# EAGLE schematic LightFixture1 (EAGLE 7.7.0)
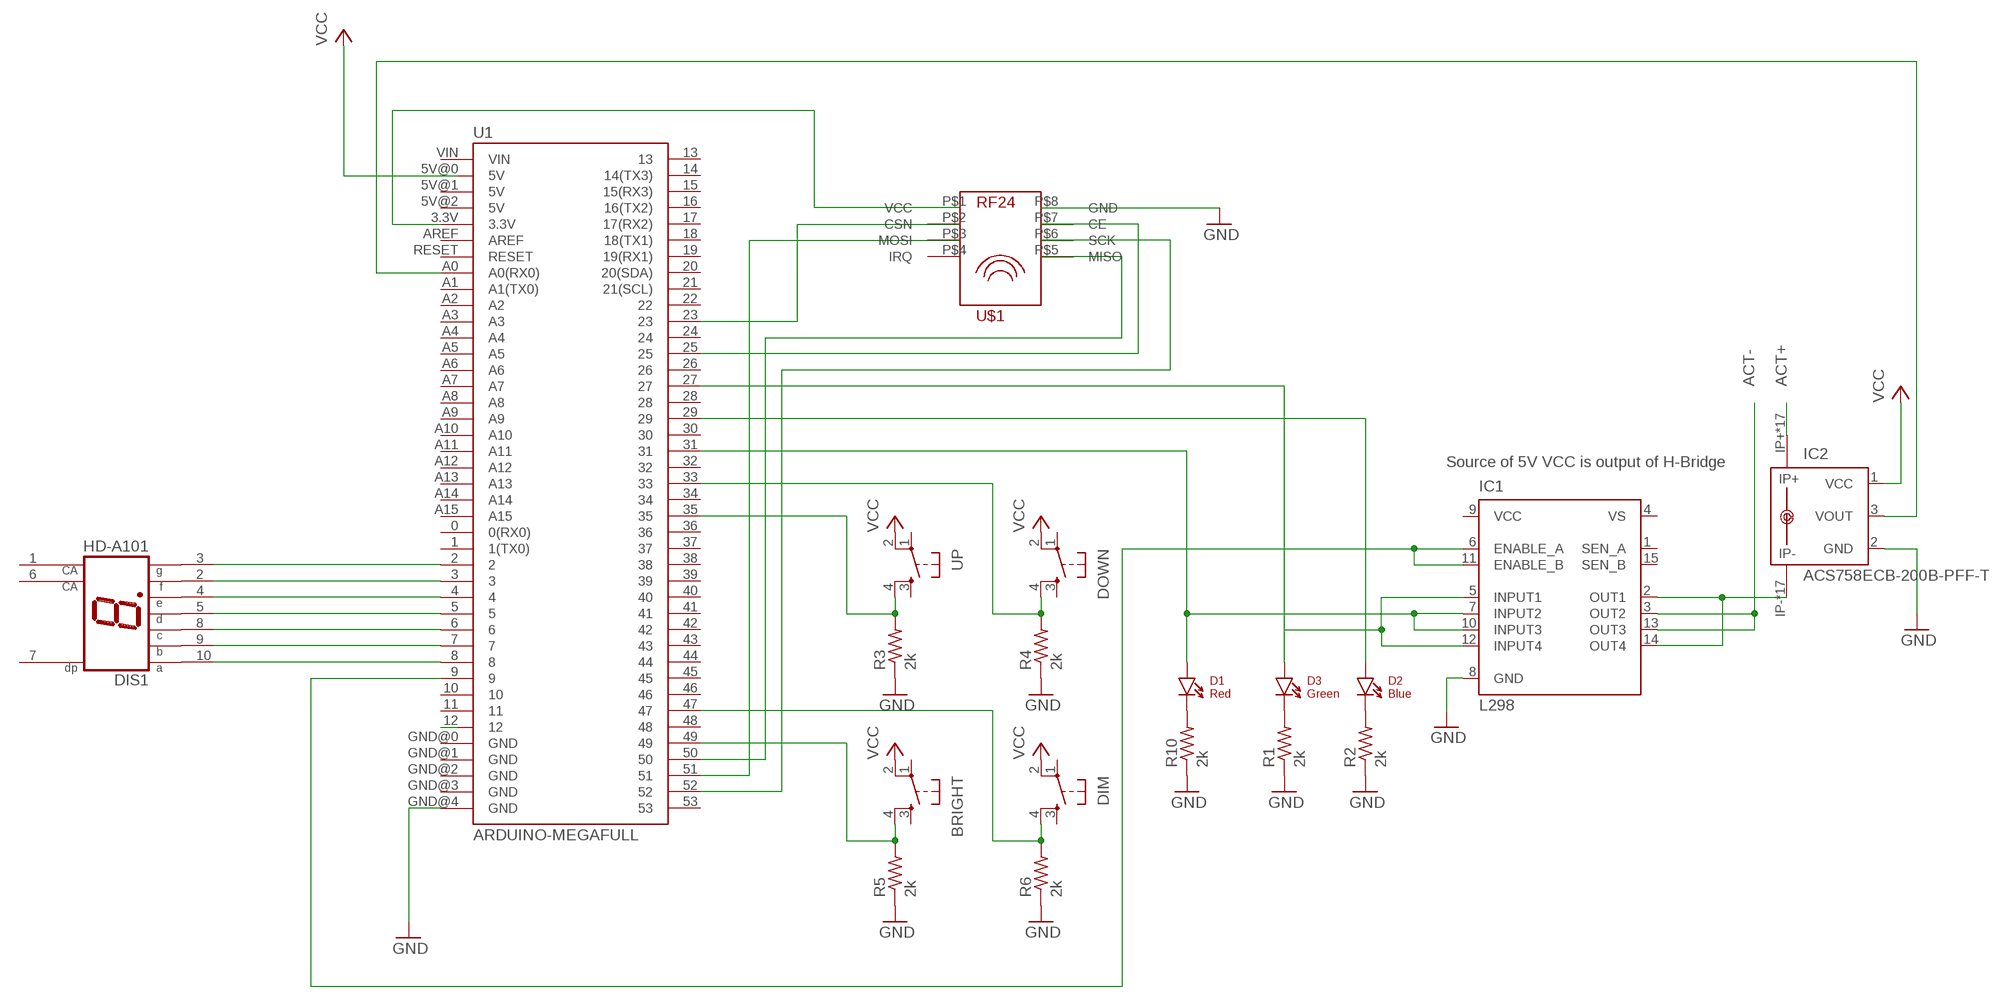
[diagram p0: schematic, sheet 1]

## Parts
BRIGHT  TAC_SWITCHPTH  [TACTILE-PTH]
D1  Red  LTE-302  [LTE-302]
D2  Blue  LTE-302  [LTE-302]
D3  Green  LTE-302  [LTE-302]
DIM  TAC_SWITCHPTH  [TACTILE-PTH]
DIS1  HD-A101  [HDSP-A]
DOWN  TAC_SWITCHPTH  [TACTILE-PTH]
IC1  L298  [MULTIWATT-15]
IC2  ACS758ECB-200B-PFF-T  [CB-PFF]
R1  2k  R-US_R0201  [R0201]
R2  2k  R-US_R0201  [R0201]
R3  2k  R-US_R0201  [R0201]
R4  2k  R-US_R0201  [R0201]
R5  2k  R-US_R0201  [R0201]
R6  2k  R-US_R0201  [R0201]
R10  2k  R-US_R0201  [R0201]
U1  ARDUINO-MEGAFULL  [ARDUINO_MEGA]
U$1  NRF24  [RF24]
UP  TAC_SWITCHPTH  [TACTILE-PTH]

## Nets
GND: IC1.8(GND) IC2.2(GND) R1.1 R2.1 R3.1 R4.1 R5.1 R6.1 R10.1 U1.GND@4(GND) U$1.P$8(GND)
N$1: D1.C R10.2
N$2: D3.C R1.2
N$3: D2.C R2.2
N$4: DOWN.4 R4.2 U1.33
N$5: R3.2 U1.35 UP.4
N$6: IC1.5(INPUT1) IC1.12(INPUT4)
N$7: IC1.6(ENABLE_A) IC1.11(ENABLE_B) U1.9
N$8: IC1.2(OUT1) IC1.14(OUT4) IC2.IP- IC2.IP-@2(IP-) IC2.IP-@3(IP-) IC2.IP-@4(IP-) IC2.IP-@5(IP-) IC2.IP-@6(IP-) IC2.IP-@7(IP-) IC2.IP-@8(IP-) IC2.IP-@9(IP-) IC2.IP-@10(IP-) IC2.IP-@11(IP-) IC2.IP-@12(IP-) IC2.IP-@13(IP-) IC2.IP-@14(IP-) IC2.IP-@15(IP-) IC2.IP-@16(IP-) IC2.IP-@17(IP-)
N$9: IC1.3(OUT2) IC1.13(OUT3)
N$10: IC2.3(VOUT) U1.A0(A0(RX0))
N$11: IC2.IP+ IC2.IP+@2(IP+) IC2.IP+@3(IP+) IC2.IP+@4(IP+) IC2.IP+@5(IP+) IC2.IP+@6(IP+) IC2.IP+@7(IP+) IC2.IP+@8(IP+) IC2.IP+@9(IP+) IC2.IP+@10(IP+) IC2.IP+@11(IP+) IC2.IP+@12(IP+) IC2.IP+@13(IP+) IC2.IP+@14(IP+) IC2.IP+@15(IP+) IC2.IP+@16(IP+) IC2.IP+@17(IP+)
N$12: D1.A IC1.7(INPUT2) IC1.10(INPUT3) U1.31
N$13: D3.A U1.27
N$14: U1.3.3V U$1.P$1(VCC)
N$15: U1.23 U$1.P$2(CSN)
N$16: U1.51 U$1.P$3(MOSI)
N$17: U1.50 U$1.P$5(MISO)
N$18: U1.52 U$1.P$6(SCK)
N$19: U1.25 U$1.P$7(CE)
N$20: D2.A U1.29
N$21: DIS1.3(G) U1.2
N$22: DIS1.2(F) U1.3
N$23: DIS1.4(E) U1.4
N$24: DIS1.5(D) U1.5
N$25: DIS1.8(C) U1.6
N$26: DIS1.9(B) U1.7
N$27: DIS1.10(A) U1.8
N$28: DIM.4 R6.2
N$29: BRIGHT.4 R5.2
N$30: U1.12
VCC: BRIGHT.2 DIM.2 DOWN.2 IC2.1(VCC) UP.2
Unconnected: BRIGHT.1 BRIGHT.3 DIM.1 DIM.3 DIS1.1(CA) DIS1.6(CA) DIS1.7(DP) DOWN.1 DOWN.3 IC1.1(SEN_A) IC1.15(SEN_B) U1.0(0(RX0)) U1.1(1(TX0)) U1.5V@0(5V) U1.5V@1(5V) U1.5V@2(5V) U1.10 U1.11 U1.13 U1.14(14(TX3)) U1.15(15(RX3)) U1.16(16(TX2)) U1.17(17(RX2)) U1.18(18(TX1)) U1.19(19(RX1)) U1.20(20(SDA)) U1.21(21(SCL)) U1.22 U1.24 U1.26 U1.28 U1.30 U1.32 U1.34 U1.36 U1.37 U1.38 U1.39 U1.40 U1.41 U1.42 U1.43 U1.44 U1.45 U1.46 U1.47 U1.48 U1.49 U1.53 U1.A1(A1(TX0)) U1.A2 U1.A3 U1.A4 U1.A5 U1.A6 U1.A7 U1.A8 U1.A9 U1.A10 U1.A11 U1.A12 U1.A13 U1.A14 U1.A15 U1.AREF U1.GND@0(GND) U1.GND@1(GND) U1.GND@2(GND) U1.GND@3(GND) U1.RESET U1.VIN U$1.P$4(IRQ) UP.1 UP.3

## Notes on the sheet
- ACT- | ACT+
- Source of 5V VCC is output of H-Bridge

## Power pins joined to a net without a drawn wire
VCC: IC1.9(VCC)
VS: IC1.4(VS)

## Library data of the parts
BRIGHT DIM DOWN UP = SparkFun-Retired:TAC_SWITCH: Momentary Switch Button commonly used for reset or general input. Spark Fun Electronics SKU : COM-00097 SMT- SWCH-08247
D1-D3 = SparkFun-LED:LTE-302: Through-hole side-firing 940nm IR LED
DIS1 = display-hp:HD-A101: LED DISPLAY 1-character 7 segment, decimal point right; OC_FARNELL: unknown; OC_NEWARK: unknown
IC1 = st-microelectronics:L298: DUAL FULL-BRIDGE DRIVER; MPN: L298N; OC_FARNELL: 1589425; OC_NEWARK: 32M1527
IC2 = allegro:ACS758*: Thermally Enhanced, Fully Integrated, Hall Effect-Based Linear Current Sensor with 100 micro Ohm Current Conductor display layer 49 Reference in BRD and place VIAs on circles Source: http://www.allegromicro.com/en/Products/Part_Numbers/0758/0758.pdf; MPN: ACS758ECB-200B-PFF-T; OC_FARNELL: 1718993; OC_NEWARK: 04R7127
R1-R6 R10 = resistor:R-US_: RESISTOR, American symbol
U1 = SparkFun-Boards:ARDUINO-MEGA: Arduino Mega board footprint
U$1 = myparts:NRF24

## Module ACTUATOR
Ports: 

### Library data of the parts